# EAGLE design untitled (EAGLE 9.5.2)
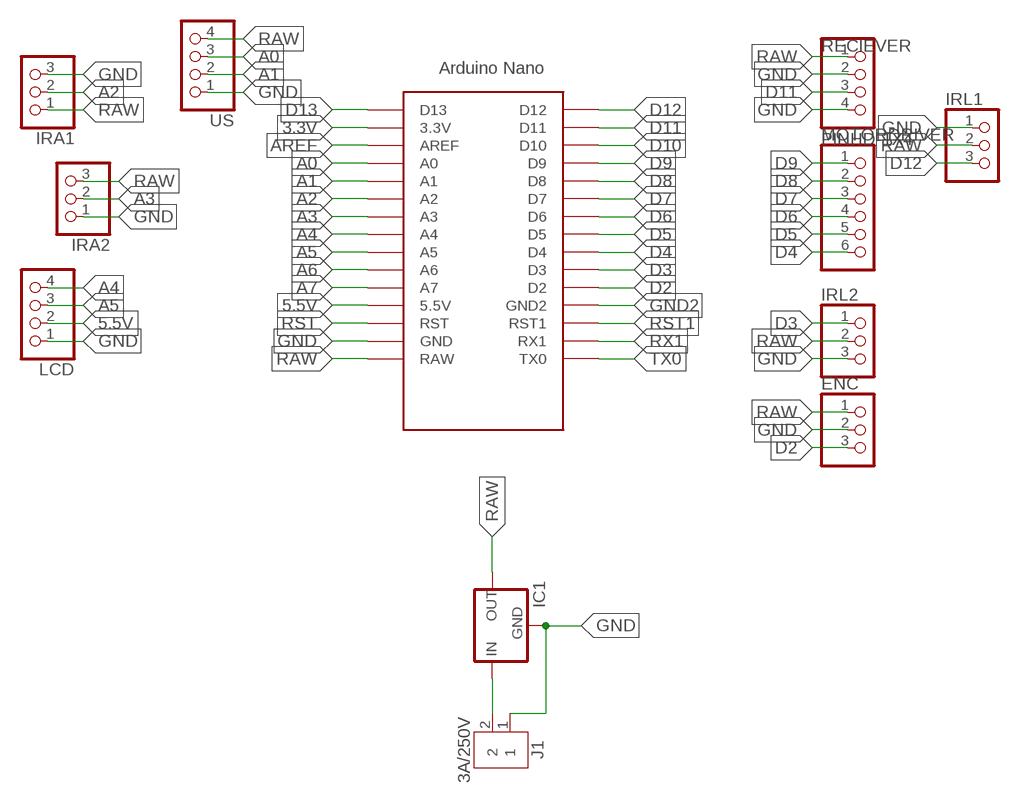
[diagram p0: schematic, sheet 1]

## Parts
ENC  PINHD-1X3  [1X03]
IC1  78XXS  [78XXS]
IRA1  PINHD-1X3  [1X03]
IRA2  PINHD-1X3  [1X03]
IRL1  PINHD-1X3  [1X03]
IRL2  PINHD-1X3  [1X03]
J1  3A/250V  B2B-XH-A  [B2B-XH-A]
LCD  PINHD-1X4  [1X04]
MOTORDRIVER  PINHD-1X6  [1X06]
RECIEVER  PINHD-1X4  [1X04]
U$1  ARDUINO_NANO  [NANO]
US  PINHD-1X4  [1X04]

## Nets
3.3V: U$1.3.3V
5.5V: LCD.2 U$1.5V(5.5V)
A0: U$1.A0 US.3
A1: U$1.A1 US.2
A2: IRA1.2 U$1.A2
A3: IRA2.2 U$1.A3
A4: LCD.4 U$1.A4
A5: LCD.3 U$1.A5
A6: U$1.A6
A7: U$1.A7
AREF: U$1.AREF
D2: ENC.3 U$1.D2
D3: IRL2.1 U$1.D3
D4: MOTORDRIVER.6 U$1.D4
D5: MOTORDRIVER.5 U$1.D5
D6: MOTORDRIVER.4 U$1.D6
D7: MOTORDRIVER.3 U$1.D7
D8: MOTORDRIVER.2 U$1.D8
D9: MOTORDRIVER.1 U$1.D9
D10: U$1.D10
D11: RECIEVER.3 U$1.D11
D12: IRL1.3 U$1.D12
D13: U$1.D13
GND: ENC.2 IC1.GND IRA1.3 IRA2.1 IRL1.1 IRL2.3 J1.1 LCD.1 RECIEVER.2 RECIEVER.4 U$1.GND US.1
GND2: U$1.GND1(GND2)
N$1: IC1.IN J1.2
RAW: ENC.1 IC1.OUT IRA1.1 IRA2.3 IRL1.2 IRL2.2 RECIEVER.1 U$1.RAW US.4
RST: U$1.RST
RST1: U$1.RST1
RX1: U$1.RX1
TX0: U$1.TX0

## Library data of the parts
ENC IRA1 IRA2 IRL1 IRL2 = MIA-Training:PINHD-1X3: PIN HEADER
IC1 = MIA_LIBRARY-2-2-2:78XXS: VOLTAGE REGULATOR
J1 = Connector:B2B-XH-A: XH Connector Top Entry - 2POS Details see: Datasheet <http://www.jst-mfg.com/product/pdf/eng/eXH.pdf>; CATEGORY: CONNECTOR; DESCRIPTION: 2.5mm pitch/disconnectable crimp style connector; MANUFACTURER: JST (XH CONNECTOR); MPN: B2B-XH-A; OPERATING_TEMPERATURE: -25°C ~ 85°C; PART_STATUS: ACTIVE; ROHS_COMPLIANT: COMPLIANT; SERIES: B_B-XH-A; SUB_CATEGORY: Through hole connector; TYPE: top entry
LCD US = MIA-Training:PINHD-1X4: PIN HEADER
MOTORDRIVER = MIA-Training:PINHD-1X6: PIN HEADER
RECIEVER = Connector:PINHD-1X4: PIN HEADER; CATEGORY: CONNECTOR; SUB-CATEGORY: PIN-HEADER
U$1 = MIA-Training:ARDUINO_NANO: Arduino Nano

## Board
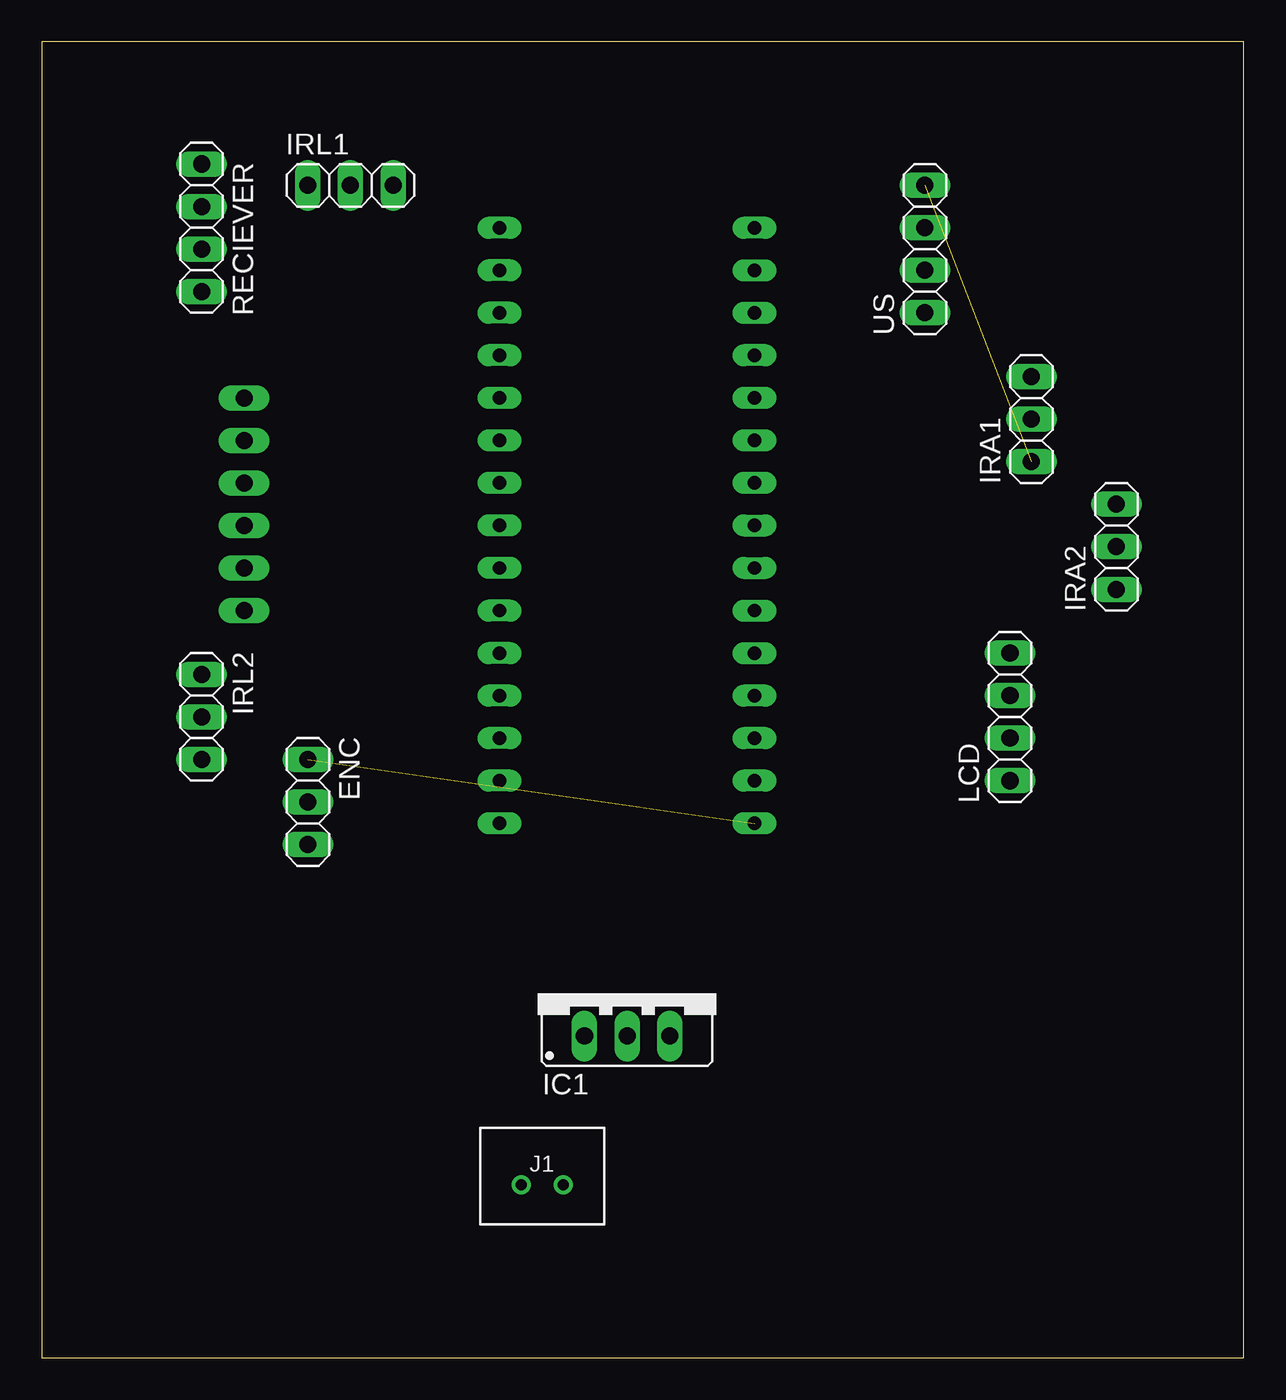
[diagram p1: board, top side]
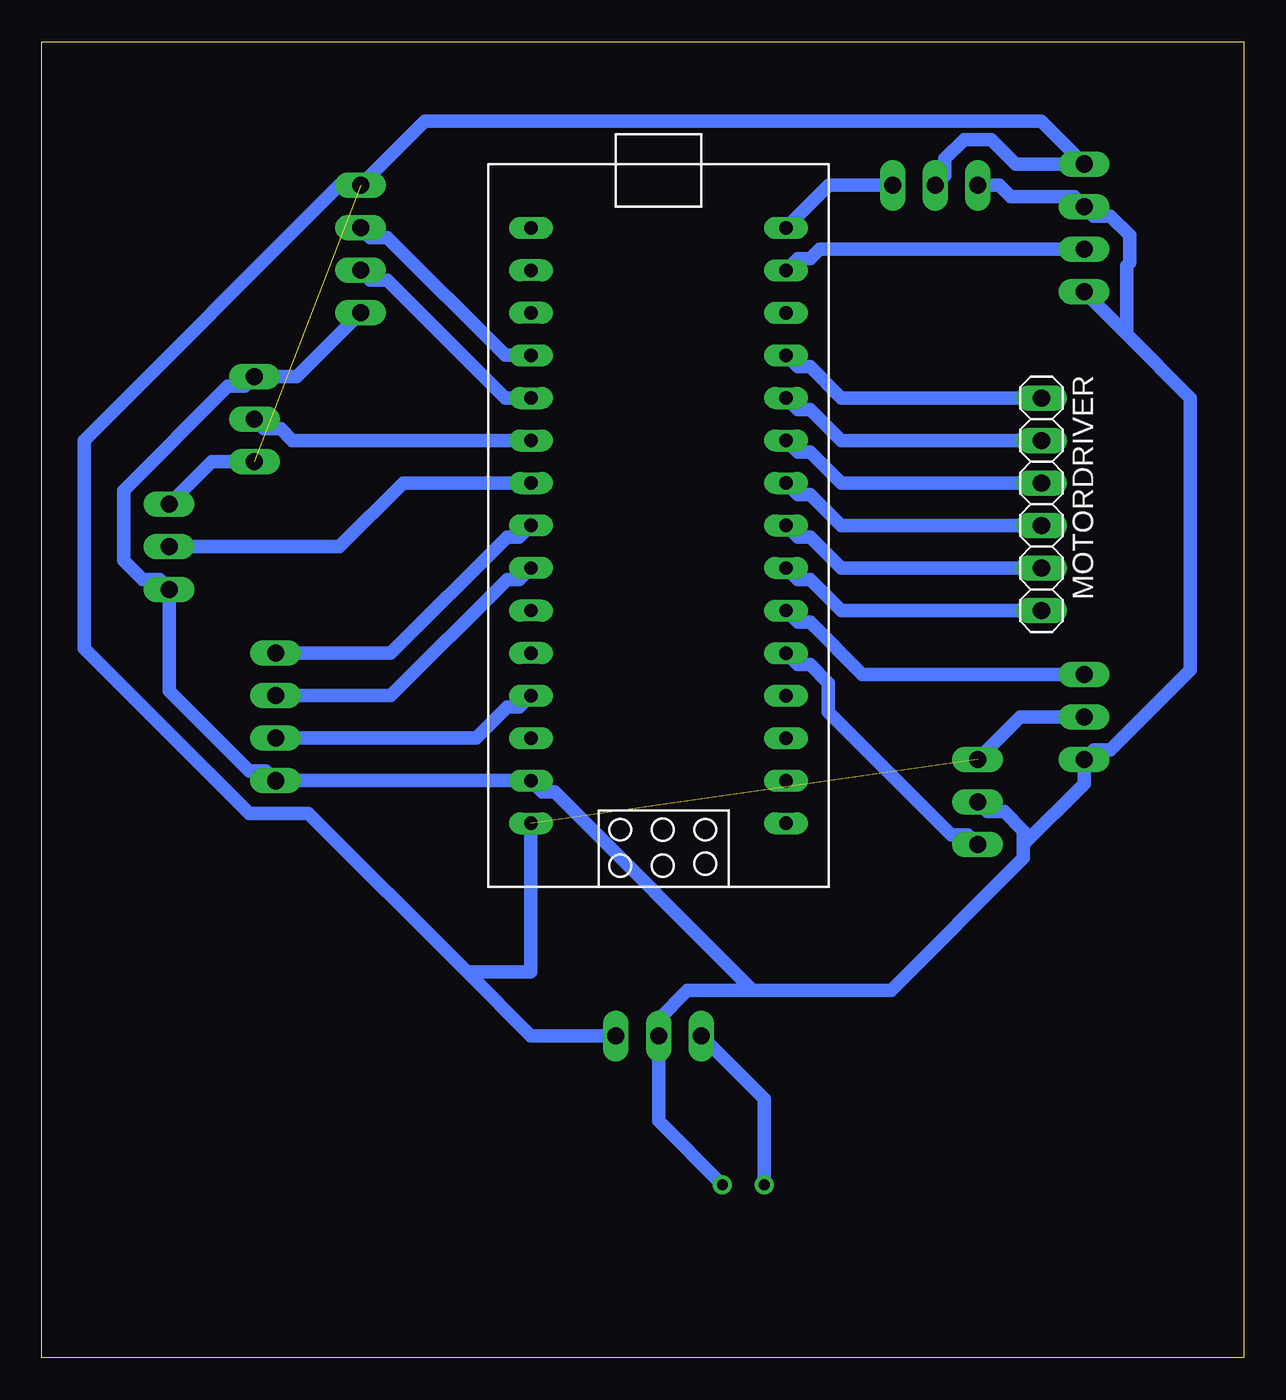
[diagram p2: board, bottom side, seen from below]

Size 71.74 x 78.57 mm. Coordinates in mm from the lower left corner, seen from the top.
Outline: 0,0 71.74,0 71.74,78.57 0,78.57 0,0
Copper layers (1*16): Top 0.035mm / dielectric 1.5mm / Bottom 0.035mm
Design rules "default *": minimum track width 0.8mm, minimum drill 0.8mm, track to track 0.8mm, track to pad 0.8mm, pad to pad 6mil, via to via 6mil, smd to smd 6mil, copper to edge 0.8mm, drill to drill 0.8mm, minimum pad ring 10mil, minimum via ring 8mil, stop-mask expansion 4mil, vias tented up to drill 0mil, thermal gap 10mil

### Footprints (pad centres in the part's own frame; a part is rotated, then mirrored left to right if it is on the bottom)
1X03 = drill 1.016 long: 1 -2.54,0; 2 0,0; 3 2.54,0
78XXS = drill 1.016 long: GND 0,-2.54; IN -2.54,-2.54; OUT 2.54,-2.54
B2B-XH-A = drill 0.64: 1 0,0; 2 2.5,0
1X04 = drill 1.016 long: 1 -3.81,0; 2 -1.27,0; 3 1.27,0; 4 3.81,0
1X06 = drill 1.016 long: 1 -6.35,0; 2 -3.81,0; 3 -1.27,0; 4 1.27,0; 5 3.81,0; 6 6.35,0
NANO = drill 0.8 long: 3.3V -10.16,24.13; 5V -10.16,-1.27; A0 -10.16,19.05; A1 -10.16,16.51; A2 -10.16,13.97; A3 -10.16,11.43; A4 -10.16,8.89; A5 -10.16,6.35; A6 -10.16,3.81; A7 -10.16,1.27; AREF -10.16,21.59; D2 5.08,1.27; D3 5.08,3.81; D4 5.08,6.35; D5 5.08,8.89; D6 5.08,11.43; D7 5.08,13.97; D8 5.08,16.51; D9 5.08,19.05; D10 5.08,21.59; D11 5.08,24.13; D12 5.08,26.67; D13 -10.16,26.67; GND -10.16,-6.35; GND1 5.08,-1.27; RAW -10.16,-8.89; RST -10.16,-3.81; RST1 5.08,-3.81; RX1 5.08,-6.35; TX0 5.08,-8.89

### Placement (x,y rotation side)
ENC  15.88,33.18 270 top
IC1  34.93,21.75 0 top
IRA1  59.06,56.04 90 top
IRA2  64.14,48.42 90 top
IRL1  18.42,70.01 0 top
IRL2  9.53,38.26 270 top
J1  31.12,10.32 180 top
LCD  57.79,38.26 90 top
MOTORDRIVER  12.07,50.96 270 bottom
RECIEVER  9.53,67.47 270 top
U$1  32.39,40.8 0 bottom
US  52.71,66.2 90 top

### Tracks (layer width: path | path; a pad name or v marks a point on that pad's centre or on a via)
5.5V
  Bottom 0.8: U$1.5V 43.24,38.84 43.97,38.84 45.83,36.99 LCD.2
A0
  Bottom 0.8: US.3 52.13,66.89 51.14,66.89 44.09,59.85 U$1.A0
A1
  Bottom 0.8: US.2 52.13,64.35 51.14,64.35 44.09,57.31 U$1.A1
A2
  Bottom 0.8: IRA1.2 58.48,55.46 57.48,55.46 56.79,54.77 U$1.A2
A3
  Bottom 0.8: IRA2.2 53.98,48.42 50.17,52.23 U$1.A3
A4
  Bottom 0.8: U$1.A4 43.24,49 43.97,49 50.91,42.07 LCD.4
A5
  Bottom 0.8: U$1.A5 43.24,46.46 43.97,46.46 50.91,39.53 LCD.3
D2
  Bottom 0.8: ENC.3 16.46,31.22 17.45,31.22 24.8,38.56 24.8,40.3 25.89,41.38 26.62,41.38 U$1.D2
D3
  Bottom 0.8: U$1.D3 26.62,43.92 25.89,43.92 22.76,40.8 IRL2.1
D4
  Bottom 0.8: U$1.D4 26.62,46.46 25.89,46.46 24.03,44.61 MOTORDRIVER.6
D5
  Bottom 0.8: U$1.D5 26.62,49 25.89,49 24.03,47.15 MOTORDRIVER.5
D6
  Bottom 0.8: U$1.D6 26.62,51.54 25.89,51.54 24.03,49.69 MOTORDRIVER.4
D7
  Bottom 0.8: U$1.D7 26.62,54.08 25.89,54.08 24.03,52.23 MOTORDRIVER.3
D8
  Bottom 0.8: U$1.D8 26.62,56.62 25.89,56.62 24.03,54.77 MOTORDRIVER.2
D9
  Bottom 0.8: U$1.D9 26.62,59.16 25.89,59.16 24.03,57.31 MOTORDRIVER.1
D11
  Bottom 0.8: RECIEVER.3 25.3,66.2 25.89,65.62 26.62,65.62 U$1.D11
D12
  Bottom 0.8: IRL1.3 24.77,70.01 U$1.D12
GND
  Bottom 0.8: J1.1 34.93,14.13 IC1.GND 34.93,20.21 33.2,21.93 29.3,21.93 | 13.16,30.64 13.16,31.45 14.3,32.6 15.3,32.6 ENC.2 | 13.16,30.64 13.16,29.83 21.05,21.93 29.3,21.93 | 29.3,21.93 41.13,33.76 41.86,33.76 U$1.GND LCD.1 58.37,35.03 59.37,35.03 64.14,39.8 IRA2.1 64.72,46.46 65.72,46.46 66.86,47.61 66.86,51.77 60.64,58 59.64,58 IRA1.3 56.52,58.58 US.1 | 13.16,30.64 9.53,34.27 IRL2.3 8.95,36.3 7.96,36.3 3.18,41.07 3.18,57.31 6.99,61.12 | 6.99,61.12 RECIEVER.4 | IRL1.1 14.61,70.01 13.91,69.32 10.11,69.32 RECIEVER.2 8.95,68.16 7.96,68.16 6.81,67.01 6.81,65.39 6.99,65.2 6.99,61.12
N$1
  Bottom 0.8: IC1.IN 28.62,15.44 J1.2
RAW  (2 unrouted)
  Bottom 0.8: U$1.RAW 42.55,23.02 46.36,23.02 | 46.36,23.02 42.55,19.21 IC1.OUT | ENC.1 13.34,38.26 IRL2.2 | IRA1.1 61.6,53.5 IRA2.3 | 46.36,23.02 55.83,32.49 59.37,32.49 69.22,42.34 69.22,54.77 53.98,70.01 US.4 48.9,73.82 12.07,73.82 RECIEVER.1 13.61,71.28 15.07,72.73 16.69,72.73 17.84,71.59 17.84,70.59 IRL1.2